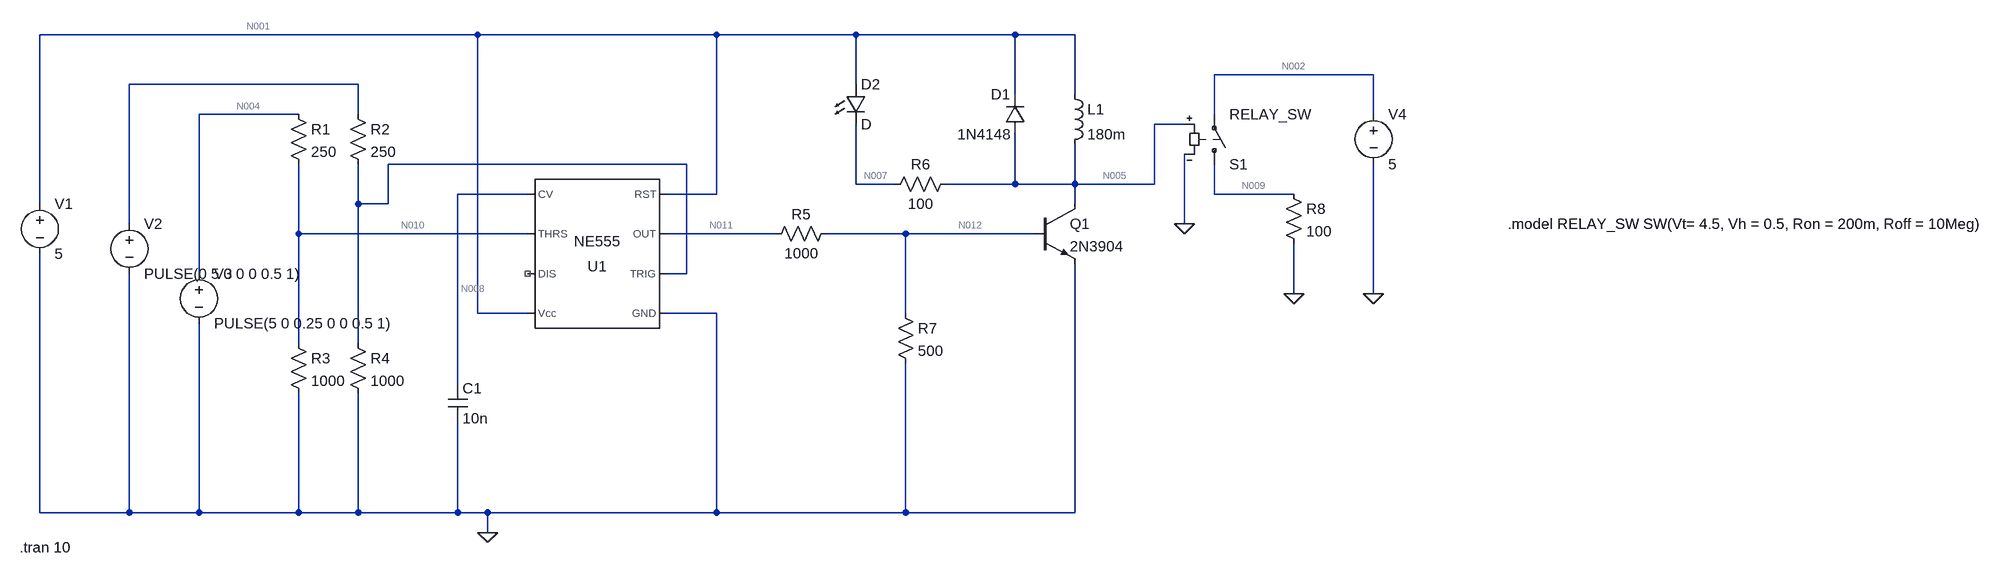
[diagram p0: schematic ECE101_PCBWAY_TUTORIAL_SIM.asc]
ECE101_PCBWAY_TUTORIAL_SIM.asc, the LTspice schematic file:
Version 4
SHEET 1 2508 680
WIRE 32 -176 -672 -176
WIRE 416 -176 32 -176
WIRE 640 -176 416 -176
WIRE 896 -176 640 -176
WIRE 992 -176 896 -176
WIRE 1472 -112 1216 -112
WIRE -160 -96 -528 -96
WIRE 640 -96 640 -176
WIRE 896 -80 896 -176
WIRE 992 -80 992 -176
WIRE -256 -48 -416 -48
WIRE -160 -48 -160 -96
WIRE 1216 -48 1216 -112
WIRE 1472 -48 1472 -112
WIRE 1168 -32 1120 -32
WIRE 368 32 -112 32
WIRE 640 64 640 -32
WIRE 704 64 640 64
WIRE 896 64 896 -16
WIRE 896 64 784 64
WIRE 992 64 992 0
WIRE 992 64 896 64
WIRE 1120 64 1120 -32
WIRE 1120 64 992 64
WIRE 112 80 0 80
WIRE 416 80 416 -176
WIRE 416 80 336 80
WIRE 1216 80 1216 32
WIRE 1344 80 1216 80
WIRE -672 96 -672 -176
WIRE -160 96 -160 32
WIRE -112 96 -112 32
WIRE -112 96 -160 96
WIRE 992 96 992 64
WIRE -528 128 -528 -96
WIRE 1168 128 1168 16
WIRE -256 144 -256 32
WIRE 112 144 -256 144
WIRE 512 144 336 144
WIRE 720 144 592 144
WIRE 928 144 720 144
WIRE -416 208 -416 -48
WIRE 368 208 368 32
WIRE 368 208 336 208
WIRE 1344 240 1344 160
WIRE 1472 240 1472 32
WIRE 32 272 32 -176
WIRE 112 272 32 272
WIRE 416 272 336 272
WIRE 720 272 720 144
WIRE -256 320 -256 144
WIRE -160 320 -160 96
WIRE 0 384 0 80
WIRE -672 592 -672 176
WIRE -528 592 -528 208
WIRE -528 592 -672 592
WIRE -416 592 -416 288
WIRE -416 592 -528 592
WIRE -256 592 -256 400
WIRE -256 592 -416 592
WIRE -160 592 -160 400
WIRE -160 592 -256 592
WIRE 0 592 0 448
WIRE 0 592 -160 592
WIRE 48 592 0 592
WIRE 416 592 416 272
WIRE 416 592 48 592
WIRE 720 592 720 352
WIRE 720 592 416 592
WIRE 992 592 992 192
WIRE 992 592 720 592
WIRE 48 624 48 592
FLAG 48 624 0
FLAG 1168 128 0
FLAG 1344 240 0
FLAG 1472 240 0
SYMBOL Misc\\NE555 224 176 R180
SYMATTR InstName U1
SYMBOL res -272 -64 R0
SYMATTR InstName R1
SYMATTR Value 250
SYMBOL res -176 -64 R0
SYMATTR InstName R2
SYMATTR Value 250
SYMBOL res -272 304 R0
SYMATTR InstName R3
SYMATTR Value 1000
SYMBOL res -176 304 R0
SYMATTR InstName R4
SYMATTR Value 1000
SYMBOL cap -16 384 R0
SYMATTR InstName C1
SYMATTR Value 10n
SYMBOL res 608 128 R90
WINDOW 0 0 56 VBottom 2
WINDOW 3 32 56 VTop 2
SYMATTR InstName R5
SYMATTR Value 1000
SYMBOL res 800 48 R90
WINDOW 0 0 56 VBottom 2
WINDOW 3 32 56 VTop 2
SYMATTR InstName R6
SYMATTR Value 100
SYMBOL res 704 256 R0
SYMATTR InstName R7
SYMATTR Value 500
SYMBOL npn 928 96 R0
SYMATTR InstName Q1
SYMATTR Value 2N3904
SYMBOL ind 976 -96 R0
SYMATTR InstName L1
SYMATTR Value 180m
SYMATTR SpiceLine Rser=500
SYMBOL diode 912 -16 R180
WINDOW 0 24 64 Left 2
WINDOW 3 24 0 Left 2
SYMATTR InstName D1
SYMATTR Value 1N4148
SYMBOL voltage -672 80 R0
WINDOW 123 0 0 Left 0
WINDOW 39 0 0 Left 0
SYMATTR InstName V1
SYMATTR Value 5
SYMBOL voltage -528 112 R0
WINDOW 123 0 0 Left 0
WINDOW 39 0 0 Left 0
SYMATTR InstName V2
SYMATTR Value PULSE(0 5 0 0 0 0.5 1)
SYMBOL voltage -416 192 R0
WINDOW 123 0 0 Left 0
WINDOW 39 0 0 Left 0
SYMATTR InstName V3
SYMATTR Value PULSE(5 0 0.25 0 0 0.5 1)
SYMBOL sw 1216 48 M180
SYMATTR InstName S1
SYMATTR Value RELAY_SW
SYMBOL res 1328 64 R0
SYMATTR InstName R8
SYMATTR Value 100
SYMBOL voltage 1472 -64 R0
WINDOW 123 0 0 Left 0
WINDOW 39 0 0 Left 0
SYMATTR InstName V4
SYMATTR Value 5
SYMBOL LED 624 -96 R0
SYMATTR InstName D2
TEXT -704 648 Left 2 !.tran 10
TEXT 1688 128 Left 2 !.model RELAY_SW SW(Vt= 4.5, Vh = 0.5, Ron = 200m, Roff = 10Meg)

The netlist it stands for:
* ECE101_PCBWAY_TUTORIAL_SIM.asc
XU1 0 N006 N011 N001 N008 N010 NC_01 N001 NE555  ; pins GND TRIG OUT RST CV THRS DIS Vcc
R1 N004 N010 250
R2 N003 N006 250
R3 N010 0 1000
R4 N006 0 1000
C1 N008 0 10n
R5 N012 N011 1000
R6 N005 N007 100
R7 N012 0 500
Q1 N005 N012 0 0 2N3904
L1 N001 N005 180m Rser=500
D1 N005 N001 1N4148
V1 N001 0 5
V2 N003 0 PULSE(0 5 0 0 0 0.5 1)
V3 N004 0 PULSE(5 0 0.25 0 0 0.5 1)
S1 N009 N002 N005 0 RELAY_SW
R8 N009 0 100
V4 N002 0 5
D2 N001 N007 D
.model D D
.lib standard.dio
.model NPN NPN
.model PNP PNP
.lib standard.bjt
.tran 10
.model RELAY_SW SW(Vt= 4.5, Vh = 0.5, Ron = 200m, Roff = 10Meg)
.lib NE555.sub
.backanno
.end

* Results of the author's LTspice run, read from the files saved beside the schematic
* Operating Point, zero values left out:
*   V(n008) = 3.333 V
*   V(n001) = 5 V
*   V(n010) = 4 V
*   V(n011) = 4.975 V
*   V(n004) = 5 V
*   V(n012) = 821.3 mV
*   V(n005) = 64.11 mV
*   V(n007) = 4.248 V
*   V(n009) = 50 µV
*   V(n002) = 5 V
*   Ic(Q1) = 51.71 mA
*   Ib(Q1) = 2.511 mA
*   Ie(Q1) = -54.22 mA
*   I(D2) = 41.84 mA
*   I(D1) = -2.525 nA
*   I(L1) = 9.872 mA
*   I(R8) = 500 nA
*   I(R7) = 1.643 mA
*   I(R6) = -41.84 mA
*   I(R5) = -4.154 mA
*   I(R3) = 4 mA
*   I(R1) = 4 mA
*   I(S1) = 500 nA
*   I(V4) = -500 nA
*   I(V3) = -4 mA
*   I(V1) = -57.48 mA
*   Ix(u1:1) = -1.611 mA
*   Ix(u1:3) = -4.154 mA
*   Ix(u1:4) = 22.67 µA
*   Ix(u1:6) = 4 nA
*   Ix(u1:8) = 5.742 mA